# EAGLE schematic GH_Terra_pre (EAGLE 6.5.0)
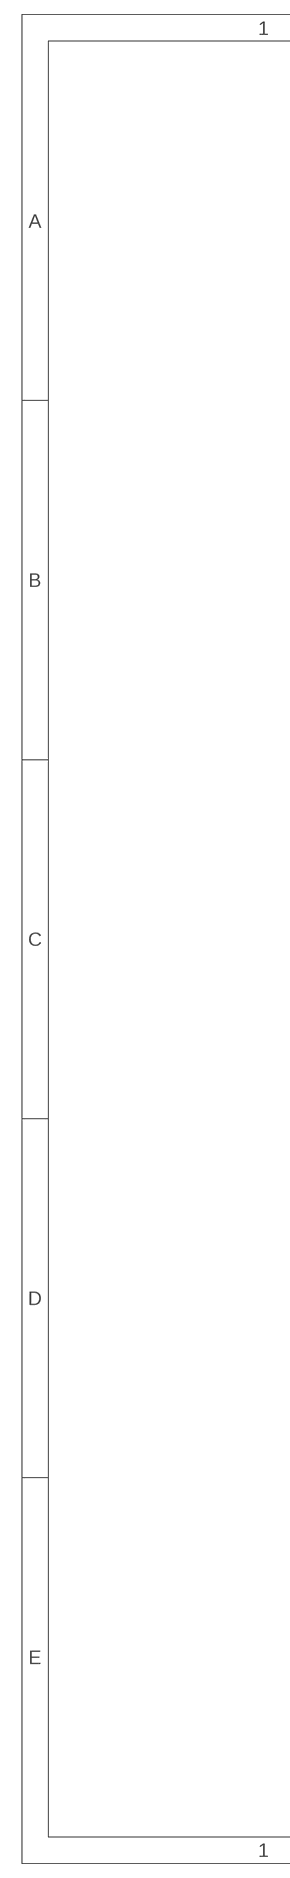
[diagram p0: schematic, sheet 1, part 1 of 2]
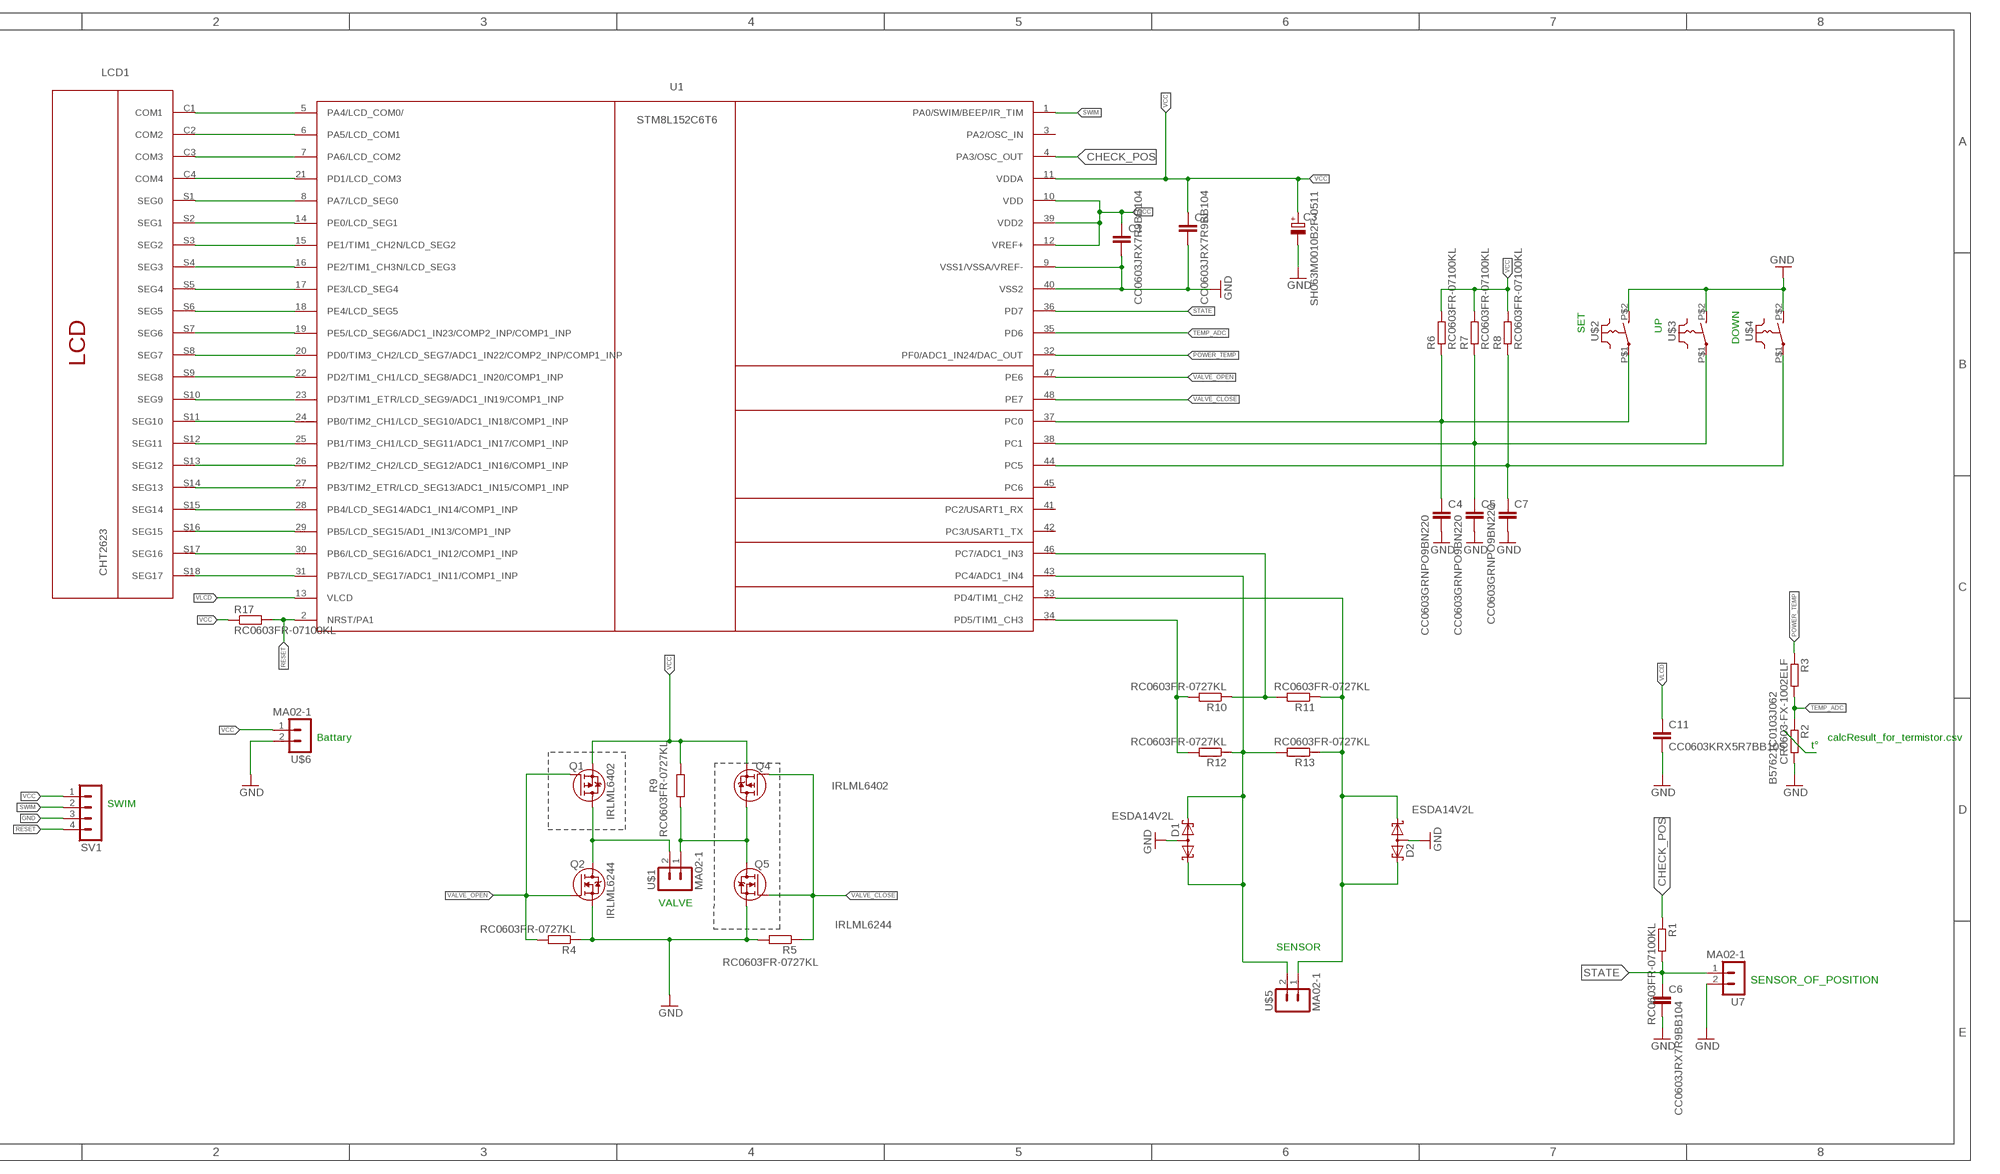
[diagram p1: schematic, sheet 1, part 2 of 2]

## Parts
C1  CC0603JRX7R9BB104  C-EUC0603  [C0603_IPC]
C2  CC0603JRX7R9BB104  C-EUC0603  [C0603_IPC]
C3  SH063M0010B2F-0511  CPOL-EUSANYO_C6  [SANYO-OSCON_C6]
C4  CC0603GRNPO9BN220  C-EUC0603  [C0603_IPC]
C5  CC0603GRNPO9BN220  C-EUC0603  [C0603_IPC]
C6  CC0603JRX7R9BB104  C-EUC0603  [C0603_IPC]
C7  CC0603GRNPO9BN220  C-EUC0603  [C0603_IPC]
C11  CC0603KRX5R7BB105  C-EUC0603  [C0603_IPC]
D1  ESDA14V2L  BAS40-06  [SOT23]
D2  ESDA14V2L  BAS40-06  [SOT23]
LCD1  CHT2623  [CHT2623]
Q1  IRLML6402  PFET-SOT23  [SOT23]
Q2  IRLML6244  NFET-SOT23  [SOT23]
Q4  IRLML6402  PFET-SOT23  [SOT23]
Q5  IRLML6244  NFET-SOT23  [SOT23]
R1  RC0603FR-07100KL  R-EU_R0603  [R0603_IPC]
R2  B57621C0103J062  R-EU_R1206  [R1206]
R3  CR0603-FX-1002ELF  R-EU_R0603  [R0603_IPC]
R4  RC0603FR-0727KL  R-EU_R0603  [R0603_IPC]
R5  RC0603FR-0727KL  R-EU_R0603  [R0603_IPC]
R6  RC0603FR-07100KL  R-EU_R0603  [R0603_IPC]
R7  RC0603FR-07100KL  R-EU_R0603  [R0603_IPC]
R8  RC0603FR-07100KL  R-EU_R0603  [R0603_IPC]
R9  RC0603FR-0727KL  R-EU_R0603  [R0603_IPC]
R10  RC0603FR-0727KL  R-EU_R0603  [R0603_IPC]
R11  RC0603FR-0727KL  R-EU_R0603  [R0603_IPC]
R12  RC0603FR-0727KL  R-EU_R0603  [R0603_IPC]
R13  RC0603FR-0727KL  R-EU_R0603  [R0603_IPC]
R17  RC0603FR-07100KL  R-EU_R0603  [R0603_IPC]
SV1  MA04-1  [MA04-1]
U1  STM8L152C6T6  STM8L152C6  [LQFP48]
U7  MA02-1  [MA02-1]
U$1  MA02-1  [MA02-1]
U$2  RK_4X3  [RK_3X4]
U$3  RK_4X3  [RK_3X4]
U$4  RK_4X3  [RK_3X4]
U$5  MA02-1  [MA02-1]
U$6  MA02-1  [MA02-1]

## Nets
CHECK_POS: R1.1 U1.4(PA3/OSC_OUT)
GND: C1.2 C2.2 C3.- C4.2 C5.2 C6.2 C7.2 C11.2 D1.3(AA) D2.3(AA) Q2.2(S) Q5.2(S) R2.2 R4.1 R5.2 SV1.3 U1.9(VSS1/VSSA/VREF-) U1.40(VSS2) U7.2 U$2.P$2(S) U$3.P$2(S) U$4.P$2(S) U$6.2
N$2: Q1.3(D) Q2.3(D) U$1.2
N$3: Q4.3(D) Q5.3(D) R9.2 U$1.1
N$7: LCD1.C1(COM1) U1.5(PA4/LCD_COM0/)
N$8: LCD1.C2(COM2) U1.6(PA5/LCD_COM1)
N$9: LCD1.C3(COM3) U1.7(PA6/LCD_COM2)
N$10: LCD1.C4(COM4) U1.21(PD1/LCD_COM3)
N$11: LCD1.S1(SEG0) U1.8(PA7/LCD_SEG0)
N$12: LCD1.S2(SEG1) U1.14(PE0/LCD_SEG1)
N$13: LCD1.S3(SEG2) U1.15(PE1/TIM1_CH2N/LCD_SEG2)
N$14: LCD1.S4(SEG3) U1.16(PE2/TIM1_CH3N/LCD_SEG3)
N$15: LCD1.S5(SEG4) U1.17(PE3/LCD_SEG4)
N$16: LCD1.S6(SEG5) U1.18(PE4/LCD_SEG5)
N$17: LCD1.S7(SEG6) U1.19(PE5/LCD_SEG6/ADC1_IN23/COMP2_INP/COMP1_INP)
N$18: LCD1.S8(SEG7) U1.20(PD0/TIM3_CH2/LCD_SEG7/ADC1_IN22/COMP2_INP/COMP1_INP)
N$19: LCD1.S9(SEG8) U1.22(PD2/TIM1_CH1/LCD_SEG8/ADC1_IN20/COMP1_INP)
N$20: LCD1.S10(SEG9) U1.23(PD3/TIM1_ETR/LCD_SEG9/ADC1_IN19/COMP1_INP)
N$21: LCD1.S11(SEG10) U1.24(PB0/TIM2_CH1/LCD_SEG10/ADC1_IN18/COMP1_INP)
N$22: LCD1.S12(SEG11) U1.25(PB1/TIM3_CH1/LCD_SEG11/ADC1_IN17/COMP1_INP)
N$23: LCD1.S13(SEG12) U1.26(PB2/TIM2_CH2/LCD_SEG12/ADC1_IN16/COMP1_INP)
N$24: LCD1.S14(SEG13) U1.27(PB3/TIM2_ETR/LCD_SEG13/ADC1_IN15/COMP1_INP)
N$25: LCD1.S15(SEG14) U1.28(PB4/LCD_SEG14/ADC1_IN14/COMP1_INP)
N$26: LCD1.S16(SEG15) U1.29(PB5/LCD_SEG15/AD1_IN13/COMP1_INP)
N$27: D2.1(K1) D2.2(K2) R11.1 R13.1 U1.33(PD4/TIM1_CH2) U$5.1
N$28: R10.2 R12.2 U1.34(PD5/TIM1_CH3)
N$29: LCD1.S17(SEG16) U1.30(PB6/LCD_SEG16/ADC1_IN12/COMP1_INP)
N$30: C4.1 R6.1 U1.37(PC0) U$2.P$1(P)
N$31: C5.1 R7.1 U1.38(PC1) U$3.P$1(P)
N$32: C7.1 R8.1 U1.44(PC5) U$4.P$1(P)
N$34: LCD1.S18(SEG17) U1.31(PB7/LCD_SEG17/ADC1_IN11/COMP1_INP)
POWER_TEMP: R3.1 U1.32(PF0/ADC1_IN24/DAC_OUT)
RESET: R17.2 SV1.4 U1.2(NRST/PA1)
STATE: C6.1 R1.2 U1.36(PD7) U7.1
SWIM: SV1.2 U1.1(PA0/SWIM/BEEP/IR_TIM)
TEMP_ADC: R2.1 R3.2 U1.35(PD6)
VALVE_CLOSE: Q4.1(G) Q5.1(G) R5.1 U1.48(PE7)
VALVE_OPEN: Q1.1(G) Q2.1(G) R4.2 U1.47(PE6)
VCC: C1.1 C2.1 C3.+ Q1.2(S) Q4.2(S) R6.2 R7.2 R8.2 R9.1 R17.1 SV1.1 U1.10(VDD) U1.11(VDDA) U1.12(VREF+) U1.39(VDD2) U$6.1
VLCD: C11.1 U1.13(VLCD)
VREF: R10.1 R11.2 U1.46(PC7/ADC1_IN3)
VREF1: D1.1(K1) D1.2(K2) R12.1 R13.2 U1.43(PC4/ADC1_IN4) U$5.2
Unconnected: U1.3(PA2/OSC_IN) U1.41(PC2/USART1_RX) U1.42(PC3/USART1_TX) U1.45(PC6)

## Notes on the sheet
- SET | UP
- DOWN
- Battary | calcResult_for_termistor.csv
- t°
- SWIM
- VALVE
- SENSOR
- SENSOR_OF_POSITION

## Library data of the parts
C1 C2 C4-C7 C11 = rcl:C-EU: CAPACITOR, European symbol
C3 = rcl:CPOL-EU: POLARIZED CAPACITOR, European symbol
D1 D2 = diode:BAS40-06: Silicon Schottky Diodes General-purpose diode for high-speed switching
LCD1 = lcd_glass:CHT2623
Q1 Q4 = semiconductor:PFET-
Q2 Q5 = semiconductor:NFET-
R1-R13 R17 = rcl:R-EU_: RESISTOR, European symbol Reflow soldering profile
SV1 = con-lstb:MA04-1: PIN HEADER
U1 = st-microelectronics:STM8L152C6
U7 U$1 U$5 U$6 = con-lstb:MA02-1
U$2-U$4 = rubber_key:RK_4X3